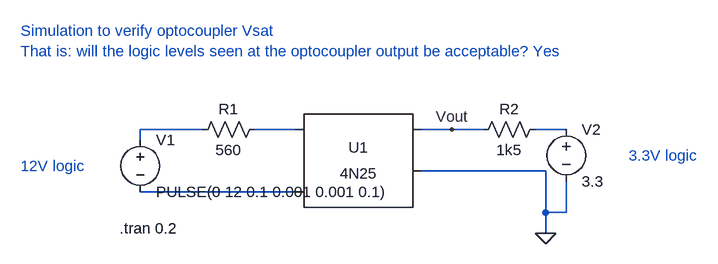
[diagram p0: schematic optocoupler.asc]
optocoupler.asc, the LTspice schematic file:
Version 4
SHEET 1 880 680
WIRE -96 64 -192 64
WIRE 48 64 -16 64
WIRE 288 64 240 64
WIRE 336 64 288 64
WIRE 464 64 416 64
WIRE -192 80 -192 64
WIRE 432 128 240 128
WIRE 48 160 -192 160
WIRE 432 192 432 128
WIRE 464 192 464 144
WIRE 464 192 432 192
WIRE 432 224 432 192
FLAG 432 224 0
FLAG 288 64 Vout
SYMBOL Optos\\4N25 144 128 R0
SYMATTR InstName U1
SYMBOL voltage -192 64 R0
WINDOW 123 0 0 Left 0
WINDOW 39 0 0 Left 0
SYMATTR InstName V1
SYMATTR Value PULSE(0 12 0.1 0.001 0.001 0.1)
SYMBOL res 0 48 R90
WINDOW 0 0 56 VBottom 2
WINDOW 3 32 56 VTop 2
SYMATTR InstName R1
SYMATTR Value 560
SYMBOL res 432 48 R90
WINDOW 0 0 56 VBottom 2
WINDOW 3 32 56 VTop 2
SYMATTR InstName R2
SYMATTR Value 1k5
SYMBOL voltage 464 48 R0
WINDOW 123 0 0 Left 0
WINDOW 39 0 0 Left 0
SYMATTR InstName V2
SYMATTR Value 3.3
TEXT -224 216 Left 2 !.tran 0.2
TEXT -376 -88 Left 2 ;Simulation to verify optocoupler Vsat\nThat is: will the logic levels seen at the optocoupler output be acceptable? Yes
TEXT -376 120 Left 2 ;12V logic
TEXT 560 104 Left 2 ;3.3V logic

The netlist it stands for:
* optocoupler.asc
XU1 N002 N004 Vout 0 NC_01 4N25
V1 N001 N004 PULSE(0 12 0.1 0.001 0.001 0.1)
R1 N002 N001 560
R2 N003 Vout 1k5
V2 N003 0 3.3
.tran 0.2
* Simulation to verify optocoupler Vsat
* That is: will the logic levels seen at the optocoupler output be acceptable? Yes
* 12V logic
* 3.3V logic
.lib 4N25.sub
.backanno
.end